# EasyEDA schematic SCH_Door Lock_2022-08-30.json
TITLE: Door Lock; REV: 1.0; Date: 2022-05-17; Sheet: 1/1; Drawn By: Maciej Miklas; Company: Maciej Miklas
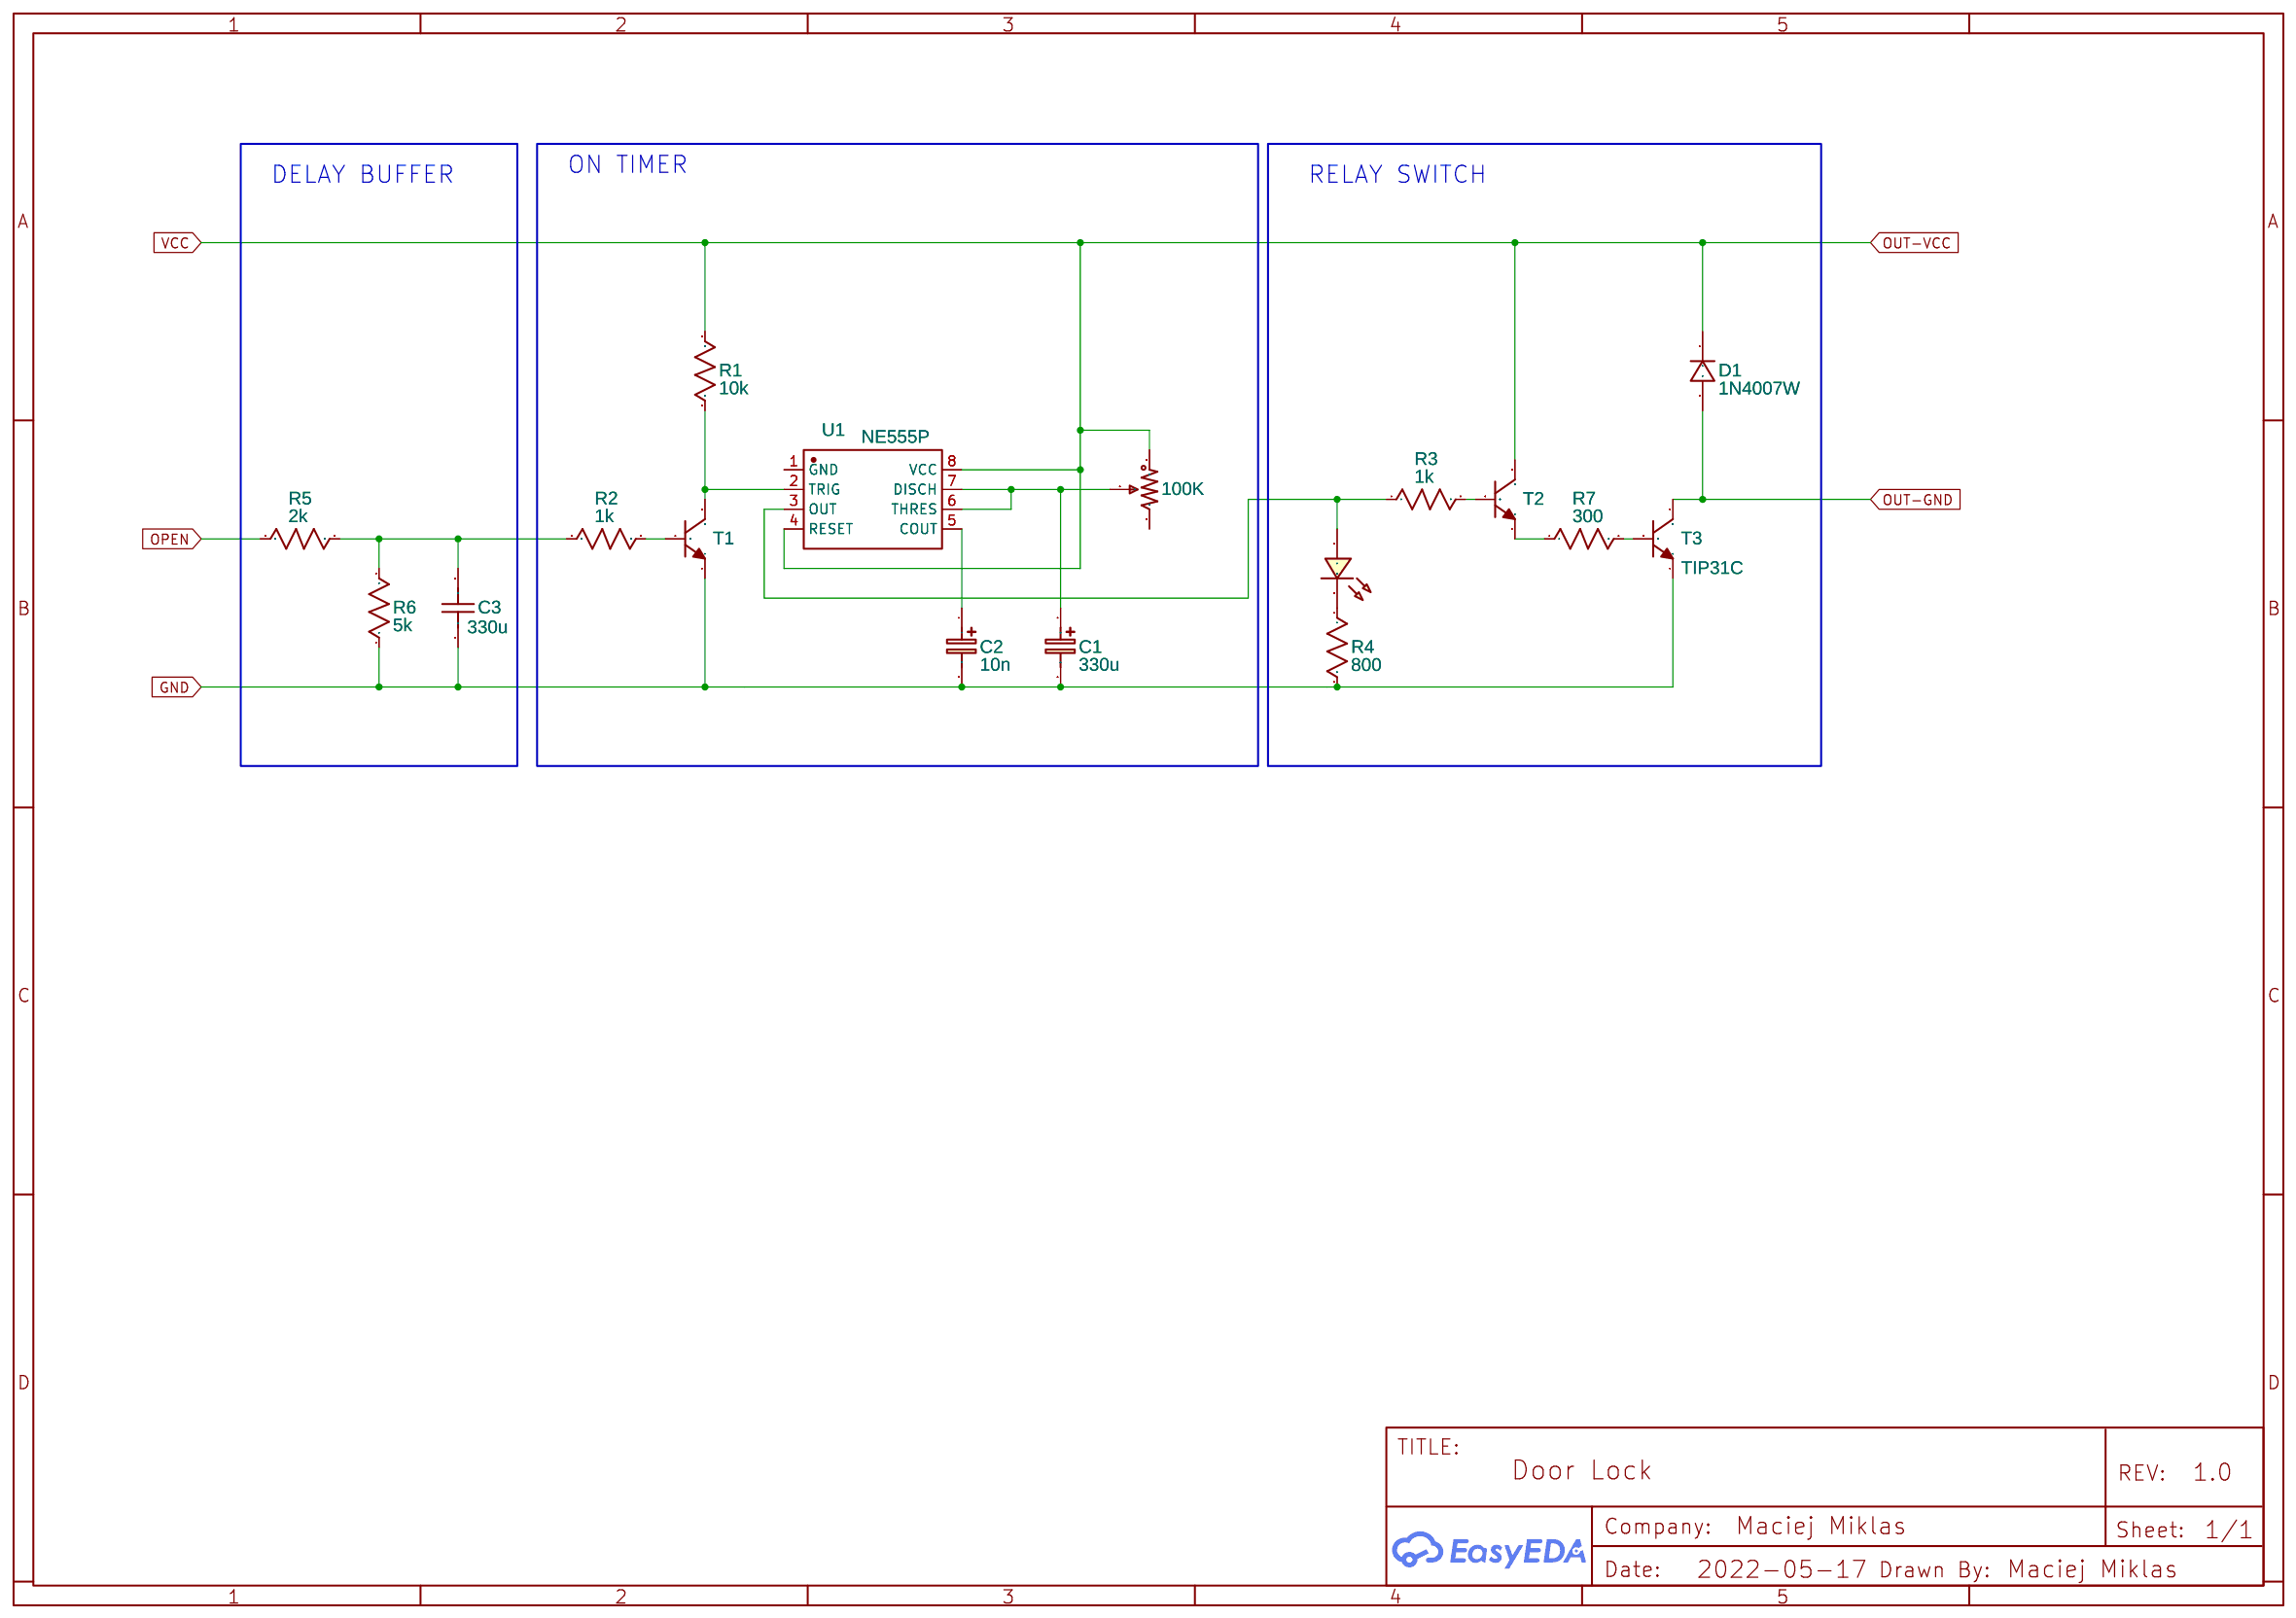
[diagram p0: schematic sheet]

## Parts
100K  R_3386P_US  [RES-ADJ-TH_3386P]
C1  330u  [CASE-A_3216]
C2  10n  [CASE-A_3216]
C3  330u  [C0603]
D1  1N4007W  [SOD-123_L2.8-W1.8-LS3.7-RD]
LED1  LED-0603_R  [LED0603_RED]
R1  10k  [R0603]
R2  1k  [R0603]
R3  1k  [R0603]
R4  800  [R0603]
R5  2k  [R0603]
R6  5k  [R0603]
R7  300  [R0603]
T1  2N3904(SOT-23)  [SOT-23-3_L2.9-W1.3-P1.90-LS2.4-TR]
T2  2N3904(SOT-23)  [SOT-23-3_L2.9-W1.3-P1.90-LS2.4-TR]
T3  TIP31C  [SOT-23-3_L2.9-W1.3-P1.90-LS2.4-TR]
U1  NE555P  [DIP-8_L9.8-W6.6-P2.54-LS7.6-BL]

## Library data of the parts
100K = R_3386P_US: Supplier: LCSC; Contributor: LCEDA_Lib; value(Ω): 10K
C1 C2 = C_Tan_SMD_A_EU: Contributor: LCEDA_Lib
C3 = C_0603_US: Contributor: LCEDA_Lib
D1 = 1N4007W: Supplier: LCSC; Supplier Part: C328592; Manufacturer: BLUE ROCKET; Contributor: LCEDA_Lib
LED1 = LED-0603_R: Manufacturer: EVERLIGHT(台湾亿光); Manufacturer Part: 19-217/R6C-AL1M2VY/3T; Supplier Part: C72044; Supplier: LCSC; Contributor: LCEDA_01
R1-R7 = R_0603_US: Contributor: LCEDA_Lib
T1-T3 = 2N3904(SOT-23): Supplier: LCSC; Manufacturer: KEC; Manufacturer Part: 2n3904S-RTK/PS; Supplier Part: C18536; Paste Type: SOT-23; Contributor: LCEDA_Lib
U1 = NE555P: Supplier: LCSC; Manufacturer: TI; Supplier Part: C46749; JLCPCB Part Class: Extended Part; Frequency: 100kHz

## Nets
GND: C1.2 C2.2 C3.1 R4.2 R6.1 T1.1(E) T3.1(E)
OPEN: R5.1
OUT-GND: D1.2 T3.3(C)
OUT-VCC: 100K.1 D1.1 R1.2 T2.3(C) U1.4(RESET) U1.8(VCC)
Net-(100K-2): 100K.2 C1.1 U1.6(THRES) U1.7(DISCH)
Net-(C2-1): C2.1 U1.5(COUT)
Net-(C3-2): C3.2 R2.1 R5.2 R6.2
Net-(LED1-1): LED1.1 R3.1 U1.3(OUT)
Net-(LED1-2): LED1.2 R4.1
Net-(R1-1): R1.1 T1.3(C) U1.2(TRIG)
Net-(R2-2): R2.2 T1.2(B)
Net-(R3-2): R3.2 T2.2(B)
Net-(R7-1): R7.1 T2.1(E)
Net-(R7-2): R7.2 T3.2(B)

Not connected (* = marked no-connect by the designer): 100K 3; U1 1(GND)

## Notes on the sheet
- DELAY BUFFER
- ON TIMER
- RELAY SWITCH
